# EasyEDA schematic 太阳能开窗检测.json
TITLE: Sheet_1; REV: 1.0; Date: 2024-04-28; Sheet: 1/1; Drawn By: ZDZX; Company: Your Company
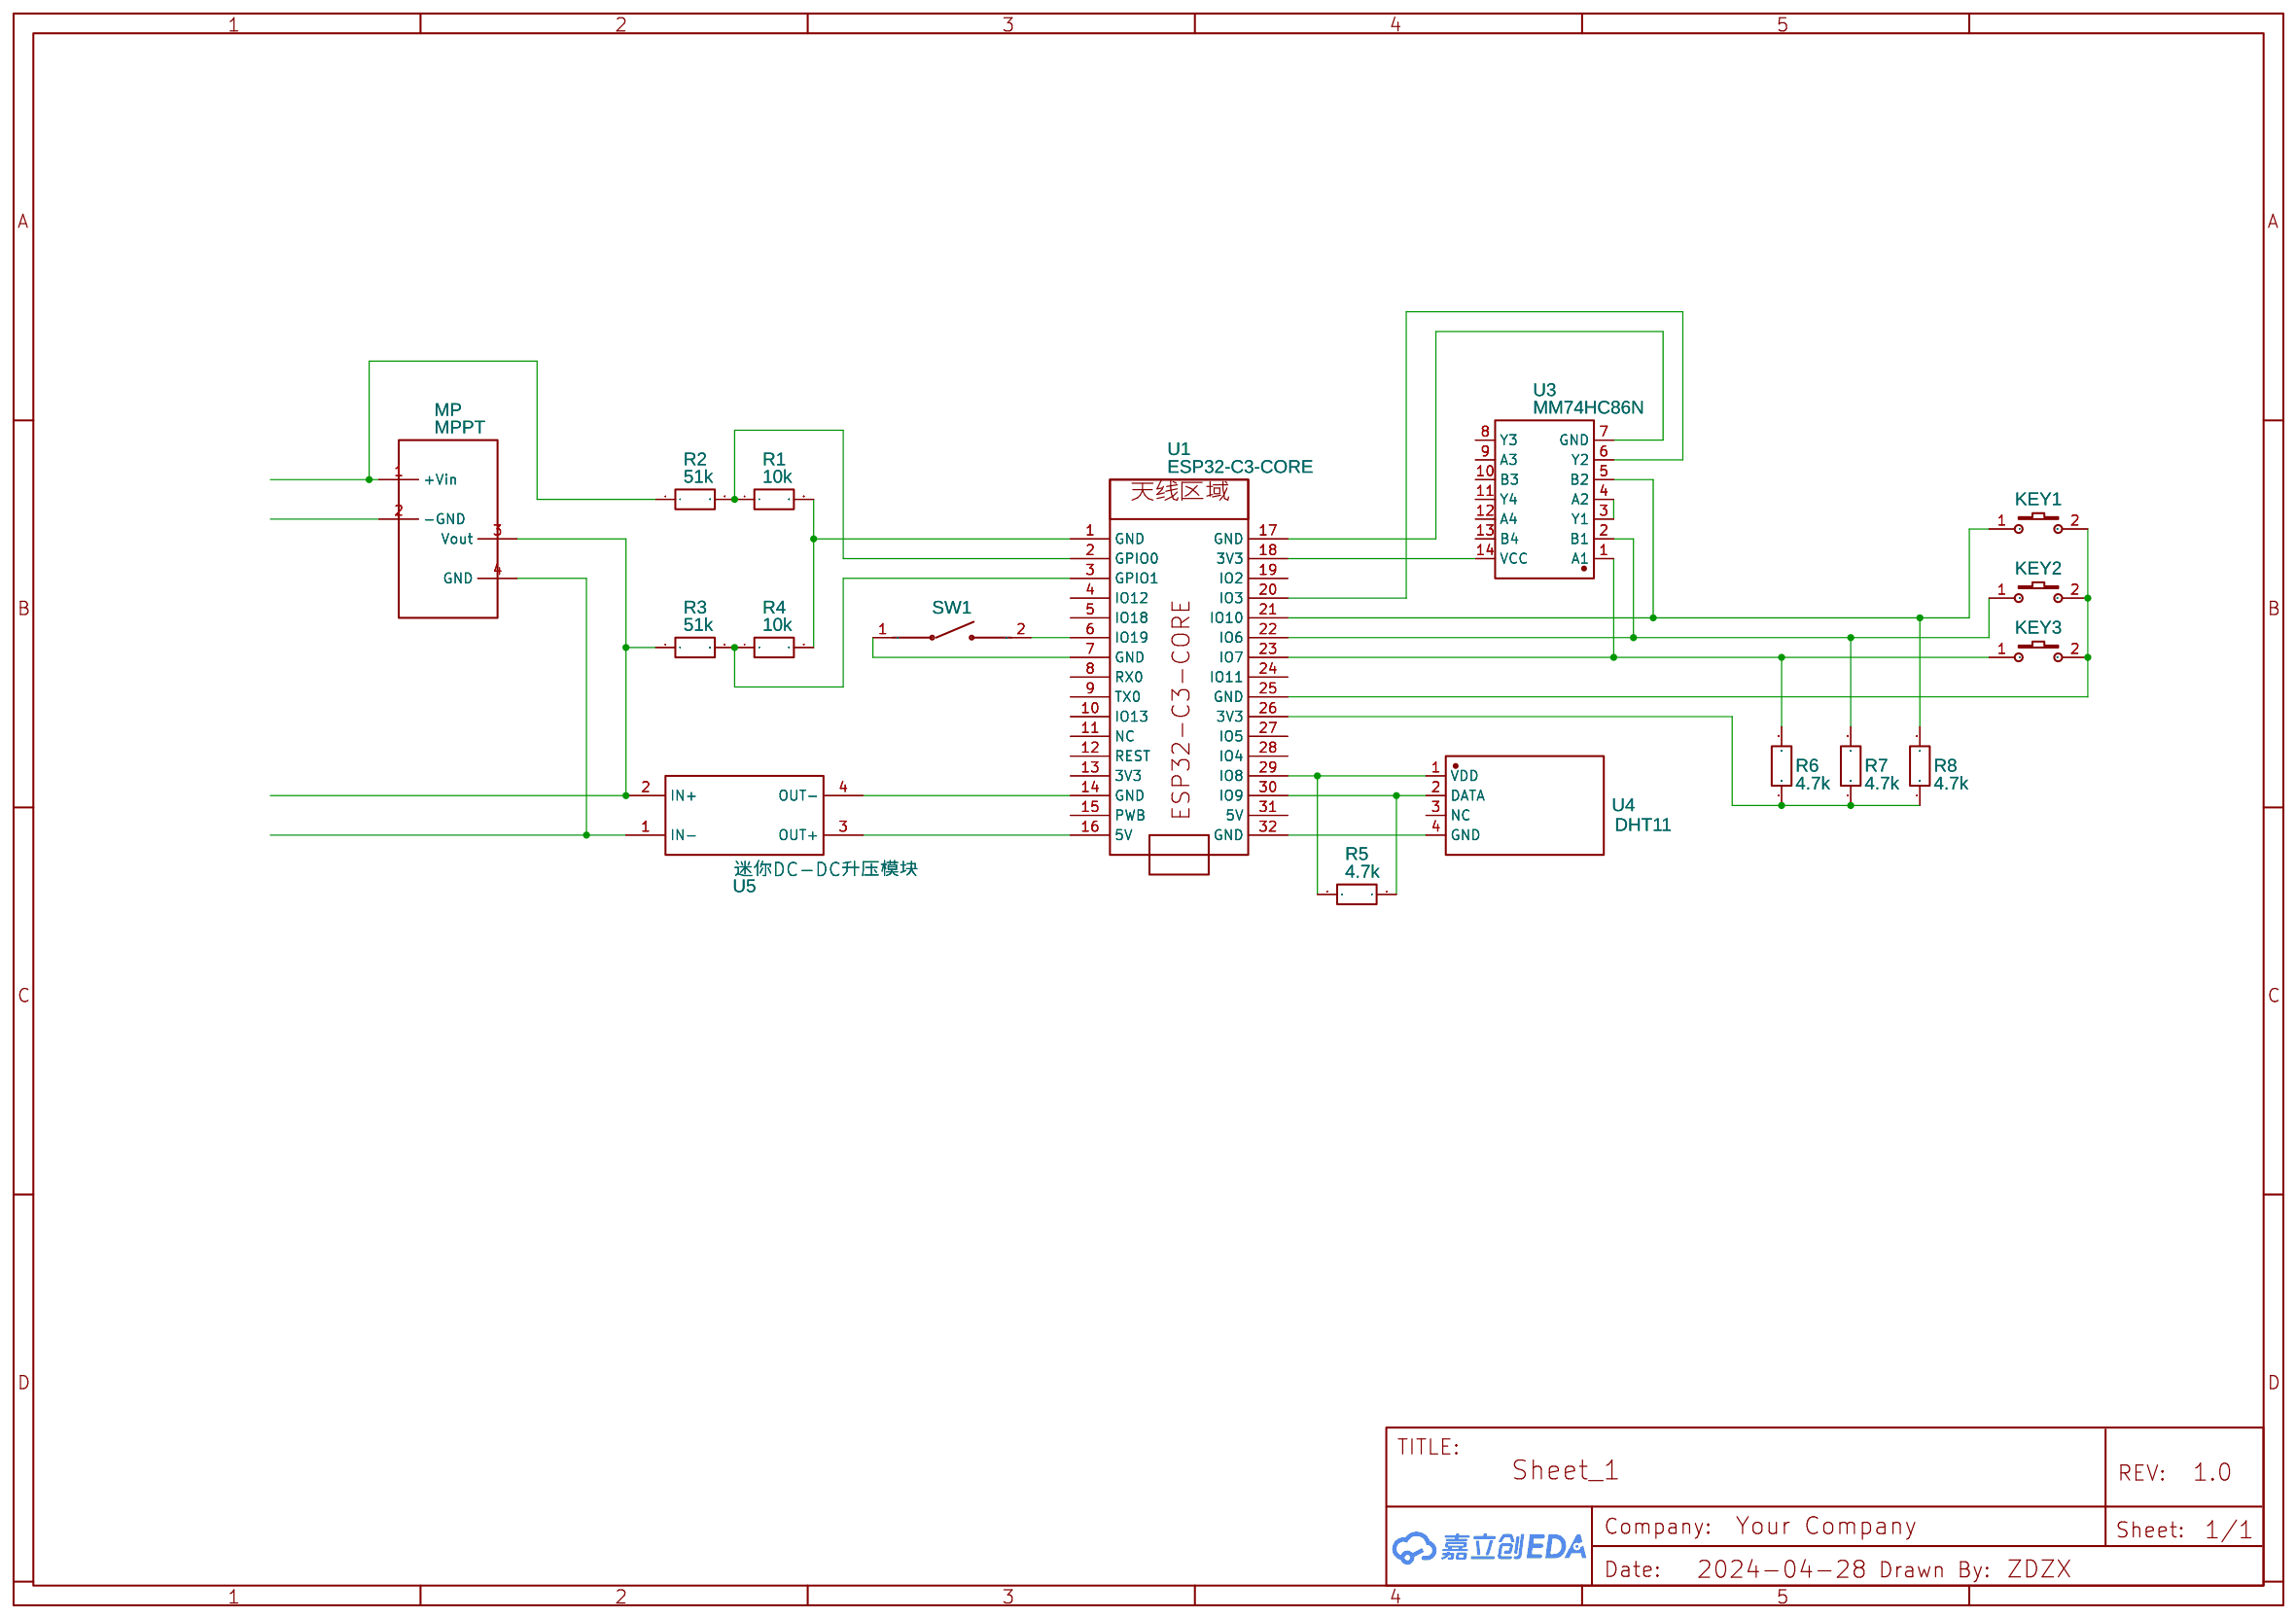
[diagram p0: schematic sheet]

## Parts
KEY1  K2-3.6×6.1_SMD  [KEY-SMD_2P-L6.2-W3.6-LS8.0]
KEY2  K2-3.6×6.1_SMD  [KEY-SMD_2P-L6.2-W3.6-LS8.0]
KEY3  K2-3.6×6.1_SMD  [KEY-SMD_2P-L6.2-W3.6-LS8.0]
MP  MPPT  [MPPT_BAT]
R1  10k  [R0603]
R2  51k  [R0603]
R3  51k  [R0603]
R4  10k  [R0603]
R5  4.7k  [R0603]
R6  4.7k  [R0603]
R7  4.7k  [R0603]
R8  4.7k  [R0603]
SW1  1-1571076-0  [SW-TH_1-1571076-0]
U1  ESP32-C3-CORE  [ESP32-C3-CORE-V2]
U3  MM74HC86N  [PDIP-14_L19.3-W6.4-P2.54-LS7.9-BL-1]
U4  DHT11  [SENSOR-TH_DHT11]
U5  迷你DC-DC升压模块  [迷你DC-DC升压模块]

## Library data of the parts
KEY1-KEY3 = K2-3.6×6.1_SMD: Supplier Part: C118141; Supplier: LCSC; Manufacturer Part: K2-1107ST-A4SW-06; Contributor: LCEDA_Lib; 制造商: 韩国韩荣
MP = MPPT: Contributor: stevenpark
R1-R8 = R_0603_EU: Contributor: LCEDA_Lib
SW1 = 1-1571076-0: Contributor: LCSC; Supplier: LCSC; Supplier Part: C266180; Manufacturer: TE Connectivity(泰科电子); JLCPCB Part Class: Extended Part
U1 = ESP32-C3-CORE: Contributor: rockee
U3 = MM74HC86N: Contributor: lcsc; Supplier: LCSC; Supplier Part: C4472762; Manufacturer: onsemi(安森美)
U4 = DHT11: Contributor: LCSC; Supplier: LCSC; Supplier Part: C117051; Manufacturer: 广州奥松; JLCPCB Part Class: Extended Part
U5 = 迷你DC-DC升压模块: Contributor: YIYEFENGYU

## Nets
Net-(KEY1-1): KEY1.1 R8.2 U1.21(IO10) U3.5(B2)
Net-(KEY1-2): KEY1.2 KEY2.2 KEY3.2 U1.25(GND)
Net-(KEY2-1): KEY2.1 R7.2 U1.22(IO6) U3.2(B1)
Net-(KEY3-1): KEY3.1 R6.2 U1.23(IO7) U3.1(A1)
Net-(MP-1): MP.1(+Vin) R2.1
Net-(MP-3): MP.3(Vout) R3.1 U5.2(IN+)
Net-(MP-4): MP.4(GND) U5.1(IN-)
Net-(R1-1): R1.1 R2.2 U1.2(GPIO0)
Net-(R1-2): R1.2 R4.2 U1.1(GND)
Net-(R3-2): R3.2 R4.1 U1.3(GPIO1)
Net-(R5-1): R5.1 U1.29(IO8) U4.1(VDD)
Net-(R5-2): R5.2 U1.30(IO9) U4.2(DATA)
Net-(R6-1): R6.1 R7.1 R8.1 U1.26(3V3)
Net-(SW1-1): SW1.1 U1.7(GND)
Net-(SW1-2): SW1.2 U1.6(IO19)
Net-(U1-14): U1.14(GND) U5.4(OUT-)
Net-(U1-16): U1.16(5V) U5.3(OUT+)
Net-(U1-17): U1.17(GND) U3.7(GND)
Net-(U1-18): U1.18(3V3) U3.14(VCC)
Net-(U1-20): U1.20(IO3) U3.6(Y2)
Net-(U1-32): U1.32(GND) U4.4(GND)
Net-(U3-3): U3.3(Y1) U3.4(A2)

Not connected (* = marked no-connect by the designer): MP 2(-GND); U1 4(IO12) 5(IO18) 8(RX0) 9(TX0) 10(IO13) 11(NC) 12(REST) 13(3V3) 15(PWB) 19(IO2) 24(IO11) 27(IO5) 28(IO4) 31(5V); U3 8(Y3) 9(A3) 10(B3) 11(Y4) 12(A4) 13(B4); U4 3(NC)
